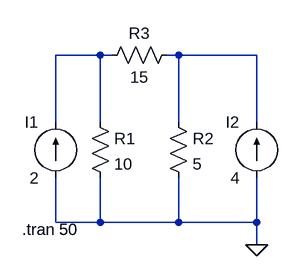
[diagram p0: schematic 1.asc]
1.asc, the LTspice schematic file:
Version 4
SHEET 1 880 680
WIRE 176 32 112 32
WIRE 192 32 176 32
WIRE 288 32 272 32
WIRE 400 32 288 32
WIRE 112 128 112 32
WIRE 176 128 176 32
WIRE 288 128 288 32
WIRE 400 128 400 32
WIRE 112 272 112 208
WIRE 176 272 176 208
WIRE 176 272 112 272
WIRE 288 272 288 208
WIRE 288 272 176 272
WIRE 400 272 400 208
WIRE 400 272 288 272
WIRE 400 304 400 272
FLAG 400 304 0
SYMBOL current 112 208 R180
WINDOW 0 24 80 Left 2
WINDOW 3 24 0 Left 2
WINDOW 123 0 0 Left 2
WINDOW 39 0 0 Left 2
SYMATTR InstName I1
SYMATTR Value 2
SYMBOL current 400 208 R180
WINDOW 0 24 80 Left 2
WINDOW 3 24 0 Left 2
WINDOW 123 0 0 Left 2
WINDOW 39 0 0 Left 2
SYMATTR InstName I2
SYMATTR Value 4
SYMBOL res 160 112 R0
SYMATTR InstName R1
SYMATTR Value 10
SYMBOL res 272 112 R0
SYMATTR InstName R2
SYMATTR Value 5
SYMBOL res 288 16 R90
WINDOW 0 0 56 VBottom 2
WINDOW 3 32 56 VTop 2
SYMATTR InstName R3
SYMATTR Value 15
TEXT 64 282 Left 2 !.tran 50

The netlist it stands for:
* 1.asc
I1 0 N001 2
I2 0 N002 4
R1 N001 0 10
R2 N002 0 5
R3 N002 N001 15
.tran 50
.backanno
.end